# Altium schematic sheet Schematic_Rev1.SchDoc
size A4; Revision: 4; SheetNumber: 1; SheetTotal: 1
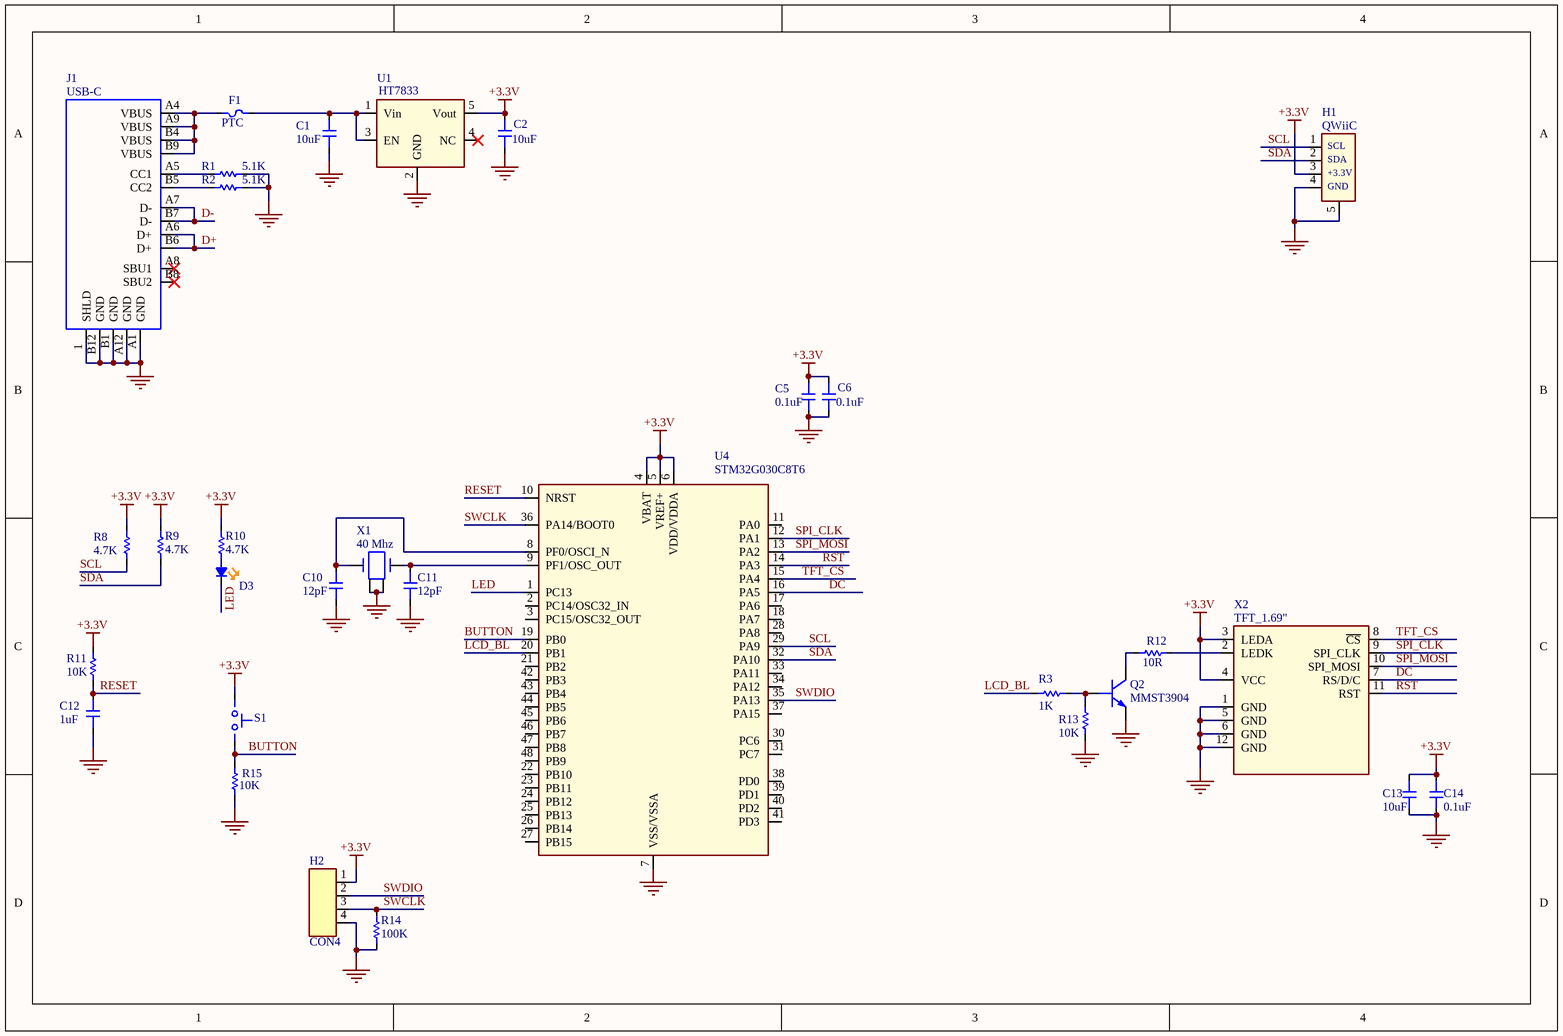
[diagram p0: Schematic_Rev1.SchDoc]

## Parts
C1  10uF  [CAPC2012X140N]
C2  10uF  [CAPC2012X140N]
C5  0.1uF  [CAPC1005X56N]
C6  0.1uF  [CAPC1005X56N]
C10  12pF  [CAPC1005X56N]
C11  12pF  [CAPC1005X56N]
C12  1uF  [CAPC1005X56N]
C13  10uF  [CAPC2012X140N]
C14  0.1uF  [CAPC1608X09L]
D3  (no value)  [LED1005X40N-Orange]
F1  PTC  [RESC1608X06L (0603 FOOTPRINT)]
H1  QWiiC  [SM04B-SRSS-TB]
H2  CON4  [HDR1X4-Empty]  (no BOM)
J1  USB-C  [TYPE-C-31-M-12]
Q2  MMST3904  [SC-70]
R1  5.1K  [RESC1005X40L (0402 FOOTPRINT)]
R2  5.1K  [RESC1005X40L (0402 FOOTPRINT)]
R3  1K  [RESC1005X40L (0402 FOOTPRINT)]
R8  4.7K  [RESC1005X40L (0402 FOOTPRINT)]
R9  4.7K  [RESC1005X40L (0402 FOOTPRINT)]
R10  4.7K  [RESC1005X40L (0402 FOOTPRINT)]
R11  10K  [RESC1005X40L (0402 FOOTPRINT)]
R12  10R  [RESC1005X40L (0402 FOOTPRINT)]
R13  10K  [RESC1005X40L (0402 FOOTPRINT)]
R14  100K  [RESC1005X40L (0402 FOOTPRINT)]
R15  10K  [RESC1005X40L (0402 FOOTPRINT)]
S1  (no value)  [TS-1088R-02526]
U1  HT7833  [SOT95P280X144-5N]
U4  STM32G030C8T6  [LQFP48 0.5MM]
X1  40 Mhz  [OSC20X16]
X2  TFT_1.69"  [TFT_GLASS 1.69 INCH SPI]

## Nets
+3.3V: C2.1 C5.2 C6.2 C13.1 C14.1 H1.3 H2.1 R8.1 R9.1 R10.1 R11.1 S1.1(A) U1.5(Vout) U4.4(VBAT) U4.5(VREF+) U4.6(VDD/VDDA) X2.3(LEDA) X2.4(VCC)
GND: C1.2 C2.2 C5.1 C6.1 C10.1 C11.1 C12.1 C13.2 C14.2 H1.4 H1.5 H2.4 J1.1(SHLD) J1.A1(GND) J1.A12(GND) J1.B1(GND) J1.B12(GND) Q2.2(E) R1.1 R2.1 R13.2 R14.2 R15.1 U1.2(GND) U4.7(VSS/VSSA) X1.2 X1.4 X2.1(GND) X2.5(GND) X2.6(GND) X2.12(GND)
BUTTON: R15.2 S1.2(B) U4.19(PB0)
D+: J1.A6(D+) J1.B6(D+)
D-: J1.A7(D-) J1.B7(D-)
DC: U4.16(PA5) X2.7(RS/D/C)
LCD_BL: R3.2 U4.20(PB1)
LED: D3.1 U4.1(PC13)
RESET: C12.2 R11.2 U4.10(NRST)
RST: U4.14(PA3) X2.11(RST)
SCL: H1.1 R8.2 U4.29(PA9)
SDA: H1.2 R9.2 U4.32(PA10)
SPI_CLK: U4.12(PA1) X2.9(SPI_CLK)
SPI_MOSI: U4.13(PA2) X2.10(SPI_MOSI)
SWCLK: H2.3 R14.1 U4.36(PA14/BOOT0)
SWDIO: H2.2 U4.35(PA13)
TFT_CS: U4.15(PA4) X2.8(~{CS})
NetC1_1: C1.1 F1.1 U1.1(Vin) U1.3(EN)
NetC10_2: C10.2 U4.8(PF0/OSCI_N) X1.1
NetC11_2: C11.2 U4.9(PF1/OSC_OUT) X1.3
NetD3_2: D3.2 R10.2
NetF1_2: F1.2 J1.A4(VBUS) J1.A9(VBUS) J1.B4(VBUS) J1.B9(VBUS)
NetJ1_A5: J1.A5(CC1) R1.2
NetJ1_B5: J1.B5(CC2) R2.2
NetQ2_1: Q2.1(B) R3.1 R13.1
NetQ2_3: Q2.3(C) R12.2
NetR12_1: R12.1 X2.2(LEDK)

Not connected (* = marked no-connect by the designer): J1 A8(SBU1)* B8(SBU2)*; U1 4(NC)*; U4 2(PC14/OSC32_IN) 3(PC15/OSC32_OUT) 11(PA0) 17(PA6) 18(PA7) 21(PB2) 22(PB10) 23(PB11) 24(PB12) 25(PB13) 26(PB14) 27(PB15) 28(PA8) 30(PC6) 31(PC7) 33(PA11) 34(PA12) 37(PA15) 38(PD0) 39(PD1) 40(PD2) 41(PD3) 42(PB3) 43(PB4) 44(PB5) 45(PB6) 46(PB7) 47(PB8) 48(PB9)

## Notes on the sheet
- (in symbol SM04B-SRSS-TB) SCL; SDA; +3.3V; GND

## Library data of the parts
C1 C2 C13 = CAP_0805: CAP 10uF 0805; Part_Footprint: 0805; Value: 10uF
C5 C6 = CAP_0402: CAP 0.1uF 0402; Part_Footprint: 0402; Value: 0.1uF
C10 C11 = CAP_0402: CAP 12pF 0402; Part_Footprint: 0402; Value: 12pF
C12 = CAP_0402: CAP 1uF 0402; Part_Footprint: 0402; Value: 1uF
C14 = CAP_0603: CAP 0.1uF 0603; Part_Footprint: 0603; Value: 0.1uF
D3 = LED_0402_SMALL_Orange: LED Orange 0402; Manufacturer: Lite-On; Part_Number: C364554; Part_Footprint: 0402; Vendor: LCSC
F1 = PTC_FUSE_0603: PTC FUSE 0.5mA hold, 1A trip 0603; Manufacturer: JDT Fuse; Part_Number: C2982257; Vendor: LCSC; Value: PTC
H1 = SM04B-SRSS-TB: CONN HEADER 4POS .100 R/A QWIIC; Manufacturer: JST; Part_Number: PRT-14417; Vendor: Digi-Key; Value: QWiiC
H2 = CON4: CONN HEADER 4POS .100" PADS; Part_Number: PADS
J1 = USB-C: CONN RECPT USB-C; Manufacturer: KHE; Part_Number: C165948; Part_Footprint: SMT; Vendor: LCSC; Value: USB-C
Q2 = MMST3904: TRANSISTOR NPN GP 40V SC-70; Manufacturer: Changjiang; Part_Number: C54879; Vendor: LCSC; Part_Footprint: SC-70; Value: MMST3904
R1 R2 = RES_0402: RES 5.1K 0402; Part_Footprint: 0402; Value: 5.1K
R3 = RES_0402: RES 1K 0402; Part_Footprint: 0402; Value: 1K
R8-R10 = RES_0402: RES 4.7K 0402; Part_Footprint: 0402; Value: 4.7K
R11 R13 R15 = RES_0402: RES 10K 0402; Part_Footprint: 0402; Value: 10K
R12 = RES_0402: RES 10R 0402; Part_Footprint: 0402; Value: 10R
R14 = RES_0402: RES 100K 0402; Part_Footprint: 0402; Value: 100K
S1 = TS-1088R-02526: Tactile Micro Switch; Part_Number: C455281; Manufacturer: XUNPU; Part_Footprint: SMD; Vendor: LCSC
U1 = HT7833: IC LDO 3.3V 0.5A SOT23-5; Manufacturer: Holtek; Part_Number: C164106; Vendor: LCSC; Value: HT7833; Part_Footprint: SOT23-5
U4 = STM32G030C8T6: IC MCU 32BIT 64KB FLASH 48LQFP; Manufacturer: ST Micro; Part_Footprint: 48LLQFP; Part_Number: STM32G030C8T6; Value: STM32G030C8T6
X1 = 40Mhz: CRYSTAL 40MHZ 10PF SMD; Part_Number: C7294701; Manufacturer: Huaxindianzi; Vendor: LCSC; Value: 40 Mhz
X2 = TFT_GLASS 1.69 INCH COLOR SPI: 1.69 INCH TFT SPI GLASS COLOR ROUNDED CORNERS; Part_Number: LH169TIG01; Vendor: Aliexpress/Alibaba; Value: TFT_1.69"